# Altium schematic sheet Flash.SchDoc
size A4
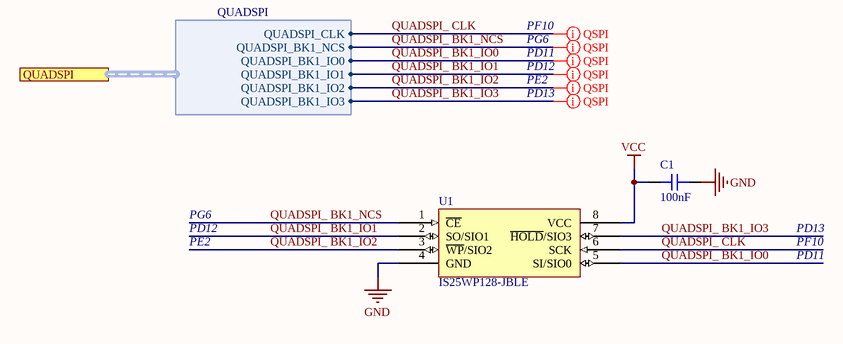
[diagram p0: Flash.SchDoc]

## Parts
C1  value 100nF  [Capacitor-0603]  (hidden comment: C-100nF-0603)
U1  IS25WP128-JBLE  [IS25WP128-JBLE]

## Ports
QUADSPI (harness QUADSPI)

## Harnesses
QUADSPI: QUADSPI_CLK, QUADSPI_BK1_NCS, QUADSPI_BK1_IO0, QUADSPI_BK1_IO1, QUADSPI_BK1_IO2, QUADSPI_BK1_IO3

## Nets
GND: C1.2 U1.4(GND)
VCC: C1.1 U1.8(VCC)
QUADSPI_ BK1_IO0: U1.5(SI/SIO0) ; port QUADSPI.QUADSPI_BK1_IO0
QUADSPI_ BK1_IO1: U1.2(SO/SIO1) ; port QUADSPI.QUADSPI_BK1_IO1
QUADSPI_ BK1_IO2: U1.3(~{WP}/SIO2) ; port QUADSPI.QUADSPI_BK1_IO2
QUADSPI_ BK1_IO3: U1.7(~{HOLD}/SIO3) ; port QUADSPI.QUADSPI_BK1_IO3
QUADSPI_ BK1_NCS: U1.1(~{CE}) ; port QUADSPI.QUADSPI_BK1_NCS
QUADSPI_ CLK: U1.6(SCK) ; port QUADSPI.QUADSPI_CLK

## Layout directives
mark named QSPI: QUADSPI_ BK1_IO0, QUADSPI_ BK1_IO1, QUADSPI_ BK1_IO2, QUADSPI_ BK1_IO3, QUADSPI_ BK1_NCS, QUADSPI_ CLK

## Notes on the sheet
- PF10
- PD11
- PD13
- PG6
- PD12
- PE2

## Library data of the parts
C1 = C-100nF-0603: Supplier 1: Digi-Key; Supplier Part Number 1: 1276-1006-1-ND
U1 = IS25WP128-JBLE: Supplier 1: Digi-Key; Supplier Part Number 1: 706-1443-ND